# Altium project ControlsBoard.PrjPcb
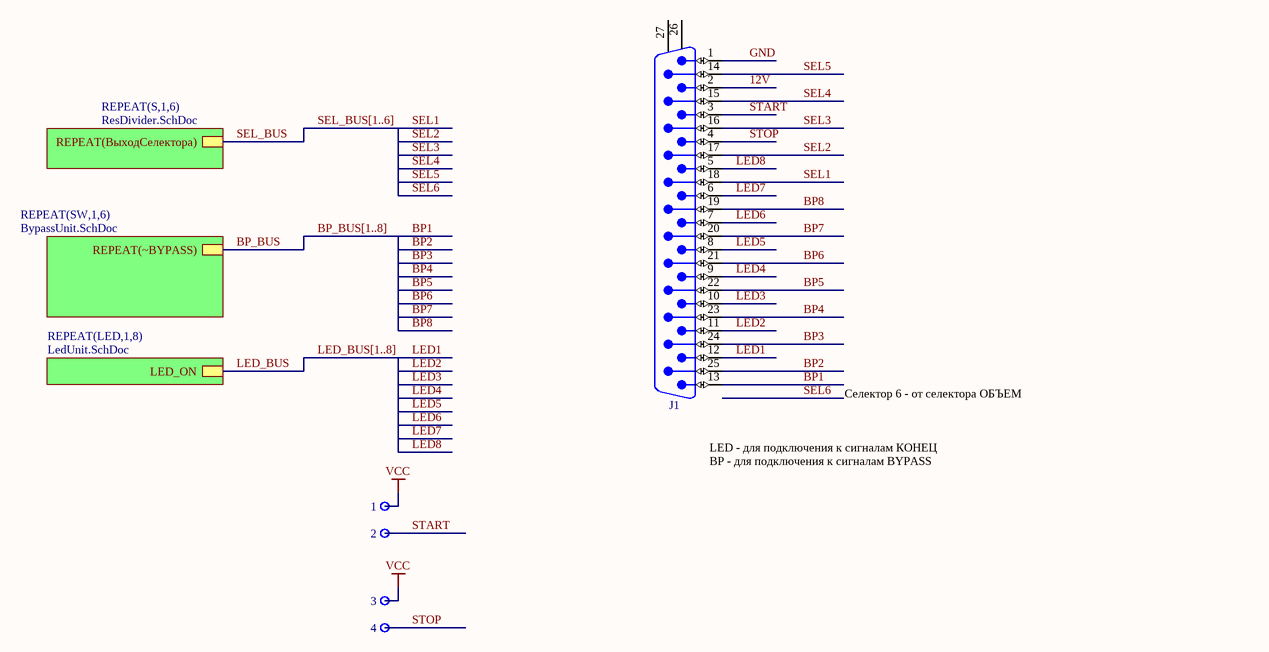
[diagram p0: ControlsBoard.SchDoc]
4 sheets, 173 parts. Net scope: hierarchical (ports join the sheet entries above them; power ports are global).
Board file: ControlsBoard.PcbDoc
Sheets:
  ControlsBoard.SchDoc
    S1 = ResDivider.SchDoc
    S2 = ResDivider.SchDoc
    S3 = ResDivider.SchDoc
    S4 = ResDivider.SchDoc
    S5 = ResDivider.SchDoc
    S6 = ResDivider.SchDoc
    SW1 = BypassUnit.SchDoc
    SW2 = BypassUnit.SchDoc
    SW3 = BypassUnit.SchDoc
    SW4 = BypassUnit.SchDoc
    SW5 = BypassUnit.SchDoc
    SW6 = BypassUnit.SchDoc
    LED1 = LedUnit.SchDoc
    LED2 = LedUnit.SchDoc
    LED3 = LedUnit.SchDoc
    LED4 = LedUnit.SchDoc
    LED5 = LedUnit.SchDoc
    LED6 = LedUnit.SchDoc
    LED7 = LedUnit.SchDoc
    LED8 = LedUnit.SchDoc

## Sheet ControlsBoard.SchDoc
size A1

### Parts
1  Plated Hole  [c180h130]  (value not drawn)
2  Plated Hole  [c180h130]  (value not drawn)
3  Plated Hole  [c180h130]  (value not drawn)
4  Plated Hole  [c180h130]  (value not drawn)
J1  D-Sub  [AMPHENOL_L717DFB25P1ATN]  (value not drawn)

### Sub-sheets
REPEAT(LED,1,8) = LedUnit.SchDoc: LED_ON
REPEAT(S,1,6) = ResDivider.SchDoc: REPEAT(ВыходСелектора)
REPEAT(SW,1,6) = BypassUnit.SchDoc: REPEAT(~BYPASS)

### Nets
VCC: 1.1 3.1
12V: J1.2
BP1: J1.13
BP2: J1.25
BP3: J1.24
BP4: J1.23
BP5: J1.22
BP6: J1.21
BP7: J1.20
BP8: J1.19
BP_BUS: sheet REPEAT(SW,1,6)/REPEAT(~BYPASS)
GND: J1.1
LED1: J1.12
LED2: J1.11
LED3: J1.10
LED4: J1.9
LED5: J1.8
LED6: J1.7
LED7: J1.6
LED8: J1.5
SEL1: J1.18
SEL2: J1.17
SEL3: J1.16
SEL4: J1.15
SEL5: J1.14
SEL_BUS: sheet REPEAT(S,1,6)/REPEAT(ВыходСелектора)
START: 2.1 J1.3
STOP: 4.1 J1.4

Not connected (* = marked no-connect by the designer): J1 26 27

### Buses and harness runs
bus BP_BUS[1..8]
bus LED_BUS[1..8]
bus SEL_BUS[1..6]

### Notes on the sheet
- Селектор 6 - от селектора ОБЪЕМ
- LED - для подключения к сигналам КОНЕЦ
  BP - для подключения к сигналам BYPASS
  SEL

### Library data of the parts
1-4 = PLATED_HOLE1.3_PAD1.8: Single Terminal Socket; Part Description: Plated Through Hole: Hole Dia.=1.3mm Pad Dia.=1.8mm; Mounted: No; Table: Pads; Part Number: PLATED_HOLE1.3_PAD1.8; Component Kind: Standard (No BOM); Component Type: Standard (No BOM); Pin Count: 1; Family: Plated Hole; Socket: No; SMD: No; Status: None; ComponentHeight: 0mm; Author: CERN DEM JLC; CreateDate: 30.10.2008; LatestRevisionDate: 30.10.2008; PackageDescription: Plated Through Hole: Hole Dia.=1.3mm Pad Dia.=1.8mm
J1 = AMPHENOL_L717DFB25P1ATN: Connector D-sub 25 Male; Part Description: Right Angled D-Sub 25 Male Contacts with Metal Bracket and Front Female Screwlock (UNC4-40); Part Number: AMPHENOL_L717DFB25P1ATN; Component Kind: Standard; Component Type: Standard; Pin Count: 27; Family: D-Sub; Mounted: Yes; Socket: No; SMD: No; Status: None; Manufacturer: AMPHENOL; Manufacturer Part Number: L717DFB25P1ATN; ComponentHeight: 13.4mm; HelpURL: \\cern.ch\dfs\Applications\Altium\Datasheets\AMPHENOL_L717DFB25P1ATN.pdf; Author: CERN DEM JLC; CreateDate: 03.06.2009; LatestRevisionDate: 14.07.2011; Table: AMPHENOL

## Sheet ResDivider.SchDoc
size A3
Used 6 times, as channels S1, S2, S3, S4, S5, S6. Parts and nets are listed once, with the designators drawn on the sheet.
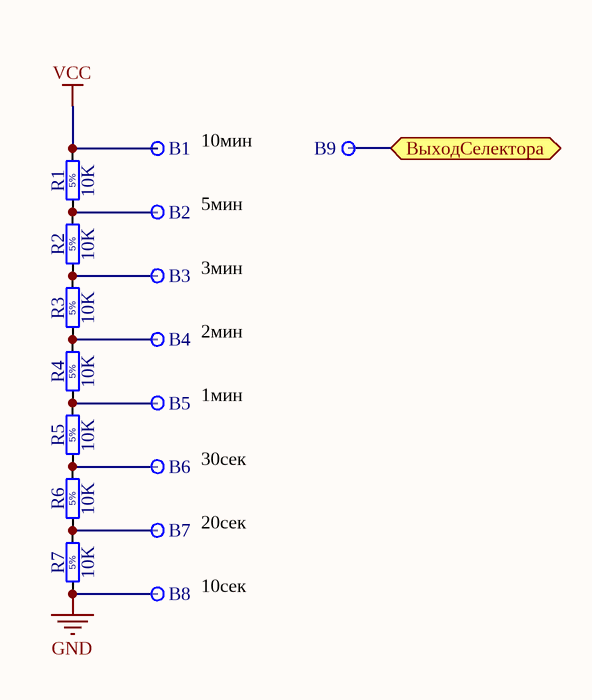
[diagram p1: ResDivider.SchDoc]

### Parts
B1  Plated Hole  [c180h130]  (value not drawn)
B2  Plated Hole  [c180h130]  (value not drawn)
B3  Plated Hole  [c180h130]  (value not drawn)
B4  Plated Hole  [c180h130]  (value not drawn)
B5  Plated Hole  [c180h130]  (value not drawn)
B6  Plated Hole  [c180h130]  (value not drawn)
B7  Plated Hole  [c180h130]  (value not drawn)
B8  Plated Hole  [c180h130]  (value not drawn)
B9  Plated Hole  [c180h130]  (value not drawn)
R1  10K  [RES_ARCOL_RCC025]
R2  10K  [RES_ARCOL_RCC025]
R3  10K  [RES_ARCOL_RCC025]
R4  10K  [RES_ARCOL_RCC025]
R5  10K  [RES_ARCOL_RCC025]
R6  10K  [RES_ARCOL_RCC025]
R7  10K  [RES_ARCOL_RCC025]

### Ports
ВыходСелектора

### Nets
GND: B8.1 R7.1
VCC: B1.1 R1.2
ВыходСелектора: B9.1 ; port ВыходСелектора
NetB2_1: B2.1 R1.1 R2.2
NetB3_1: B3.1 R2.1 R3.2
NetB4_1: B4.1 R3.1 R4.2
NetB5_1: B5.1 R4.1 R5.2
NetB6_1: B6.1 R5.1 R6.2
NetB7_1: B7.1 R6.1 R7.2

### Channels
S1: designators end in _S1; ports ВыходСелектора=SEL_BUS1
S2: designators end in _S2; ports ВыходСелектора=SEL_BUS2
S3: designators end in _S3; ports ВыходСелектора=SEL_BUS3
S4: designators end in _S4; ports ВыходСелектора=SEL_BUS4
S5: designators end in _S5; ports ВыходСелектора=SEL_BUS5
S6: designators end in _S6; ports ВыходСелектора=SEL_BUS6

### Notes on the sheet
- 10мин
- 5мин
- 3мин
- 2мин
- 1мин
- 30сек
- 20сек
- 10сек
- (in symbol RCF_5K1_5%_0.25W_+10-6PPM_ARCOL_RCC025) 5%

### Library data of the parts
B1-B9 = PLATED_HOLE1.3_PAD1.8: as 1 on sheet ControlsBoard; Part Number: PLATED_HOLE1.3_PAD1.8; Component Kind: Standard (No BOM); Component Type: Standard (No BOM); Pin Count: 1; Family: Plated Hole; Socket: No; SMD: No; Status: None; ComponentHeight: 0mm; Author: CERN DEM JLC; CreateDate: 30.10.2008; LatestRevisionDate: 30.10.2008; PackageDescription: Plated Through Hole: Hole Dia.=1.3mm Pad Dia.=1.8mm
R1-R7 = RCF_5K1_5%_0.25W_+10-6PPM_ARCOL_RCC025: Resistor - 5%; Part Description: Solid Carbon Resistor RCC Series; Manufacturer: ARCOL; Manufacturer Part Number: RCC025 5k1 J; Power: 0.25W; TC: +10-6ppm/°C; Table: Resistors THD; Part Number: RCF_5K1_5%_0.25W_+10-6PPM_ARCOL_RCC025; Component Kind: Standard; Component Type: Standard; Pin Count: 2; Value: 10K; Status: None; Tolerance: ±5%; Case: LS10.16 L6.3 x D2.4; Mounted: Yes; Socket: No; SMD: No; ComponentHeight: 2.5mm; HelpURL: \\cern.ch\dfs\Applications\Altium\Datasheets\RCF_ARCOL_RCC025.pdf; Author: CERN DEM JLC; CreateDate: 30.10.2013; LatestRevisionDate: 30.10.2013

## Sheet BypassUnit.SchDoc
size A4
Used 6 times, as channels SW1, SW2, SW3, SW4, SW5, SW6. Parts and nets are listed once, with the designators drawn on the sheet.
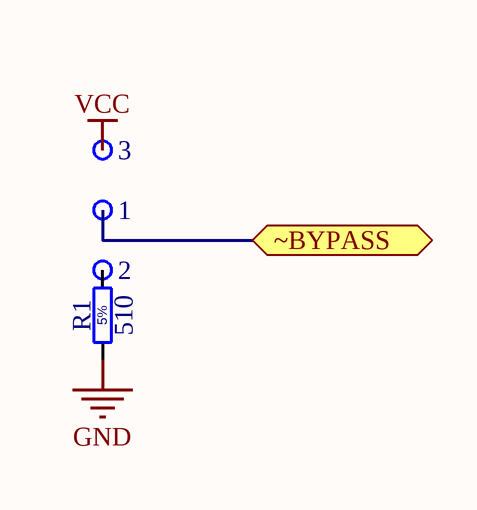
[diagram p2: BypassUnit.SchDoc]

### Parts
1  Plated Hole  [c180h130]  (value not drawn)
2  Plated Hole  [c180h130]  (value not drawn)
3  Plated Hole  [c180h130]  (value not drawn)
R1  510  [RES_ARCOL_RCC025]

### Ports
~BYPASS

### Nets
GND: R1.1
VCC: 3.1
~BYPASS: 1.1 ; port ~BYPASS
Net2_1: 2.1 R1.2

### Channels
SW1: designators end in _SW1; ports ~BYPASS=BP_BUS1
SW2: designators end in _SW2; ports ~BYPASS=BP_BUS2
SW3: designators end in _SW3; ports ~BYPASS=BP_BUS3
SW4: designators end in _SW4; ports ~BYPASS=BP_BUS4
SW5: designators end in _SW5; ports ~BYPASS=BP_BUS5
SW6: designators end in _SW6; ports ~BYPASS=BP_BUS6

### Notes on the sheet
- (in symbol RCF_5K1_5%_0.25W_+10-6PPM_ARCOL_RCC025) 5%

### Library data of the parts
1-3 = PLATED_HOLE1.3_PAD1.8: as 1 on sheet ControlsBoard; Part Number: PLATED_HOLE1.3_PAD1.8; Component Kind: Standard (No BOM); Component Type: Standard (No BOM); Pin Count: 1; Family: Plated Hole; Socket: No; SMD: No; Status: None; ComponentHeight: 0mm; Author: CERN DEM JLC; CreateDate: 30.10.2008; LatestRevisionDate: 30.10.2008; PackageDescription: Plated Through Hole: Hole Dia.=1.3mm Pad Dia.=1.8mm
R1 = RCF_5K1_5%_0.25W_+10-6PPM_ARCOL_RCC025: as R1 on sheet ResDivider; Part Number: RCF_5K1_5%_0.25W_+10-6PPM_ARCOL_RCC025; Component Kind: Standard; Component Type: Standard; Pin Count: 2; Value: 510; Status: None; Tolerance: ±5%; Case: LS10.16 L6.3 x D2.4; Mounted: Yes; Socket: No; SMD: No; ComponentHeight: 2.5mm; HelpURL: \\cern.ch\dfs\Applications\Altium\Datasheets\RCF_ARCOL_RCC025.pdf; Author: CERN DEM JLC; CreateDate: 30.10.2013; LatestRevisionDate: 30.10.2013

## Sheet LedUnit.SchDoc
size A4
Used 8 times, as channels LED1, LED2, LED3, LED4, LED5, LED6, LED7, LED8. Parts and nets are listed once, with the designators drawn on the sheet.
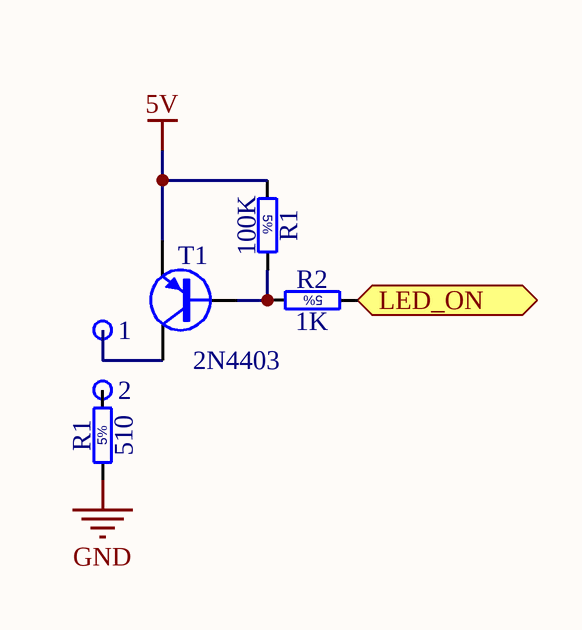
[diagram p3: LedUnit.SchDoc]

### Parts
(Parts that share a designator on the sheet are numbered #1, #2 ... from top to bottom, then left to right.)
1  Plated Hole  [c180h130]  (value not drawn)
2  Plated Hole  [c180h130]  (value not drawn)
R1#1  100K  [RES_ARCOL_RCC025]
R1#2  510  [RES_ARCOL_RCC025]
R2  1K  [RES_ARCOL_RCC025]
T1  2N4403  [TO-92AA-P254]

### Ports
LED_ON

### Nets
5V: R1#1.2 T1.1(E)
GND: R1#2.1
LED_ON: R2.1 ; port LED_ON
Net1_1: 1.1 T1.3(C)
Net2_1: 2.1 R1#2.2
NetR1#1_1: R1#1.1 R2.2 T1.2(B)

### Channels
LED1: designators 1=1_LED1 2=2_LED1 R1=R1_LED1#2 R1=R1_LED1#1 R2=R2_LED1 T1=T1_LED1; ports LED_ON=LED_BUS
LED2: designators 1=1_LED2 2=2_LED2 R1=R1_LED2#2 R1=R1_LED2#1 R2=R2_LED2 T1=T1_LED2; ports LED_ON=LED_BUS
LED3: designators 1=1_LED3 2=2_LED3 R1=R1_LED3#2 R1=R1_LED3#1 R2=R2_LED3 T1=T1_LED3; ports LED_ON=LED_BUS
LED4: designators 1=1_LED4 2=2_LED4 R1=R1_LED4#2 R1=R1_LED4#1 R2=R2_LED4 T1=T1_LED4; ports LED_ON=LED_BUS
LED5: designators 1=1_LED5 2=2_LED5 R1=R1_LED5#2 R1=R1_LED5#1 R2=R2_LED5 T1=T1_LED5; ports LED_ON=LED_BUS
LED6: designators 1=1_LED6 2=2_LED6 R1=R1_LED6#2 R1=R1_LED6#1 R2=R2_LED6 T1=T1_LED6; ports LED_ON=LED_BUS
LED7: designators 1=1_LED7 2=2_LED7 R1=R1_LED7#2 R1=R1_LED7#1 R2=R2_LED7 T1=T1_LED7; ports LED_ON=LED_BUS
LED8: designators 1=1_LED8 2=2_LED8 R1=R1_LED8#2 R1=R1_LED8#1 R2=R2_LED8 T1=T1_LED8; ports LED_ON=LED_BUS

### Notes on the sheet
- (in symbol RCF_5K1_5%_0.25W_+10-6PPM_ARCOL_RCC025) 5%

### Library data of the parts
1 2 = PLATED_HOLE1.3_PAD1.8: as 1 on sheet ControlsBoard; Part Number: PLATED_HOLE1.3_PAD1.8; Component Kind: Standard (No BOM); Component Type: Standard (No BOM); Pin Count: 1; Family: Plated Hole; Socket: No; SMD: No; Status: None; ComponentHeight: 0mm; Author: CERN DEM JLC; CreateDate: 30.10.2008; LatestRevisionDate: 30.10.2008; PackageDescription: Plated Through Hole: Hole Dia.=1.3mm Pad Dia.=1.8mm
R1#1 R1#2 R2 = RCF_5K1_5%_0.25W_+10-6PPM_ARCOL_RCC025: as R1 on sheet ResDivider; Part Number: RCF_5K1_5%_0.25W_+10-6PPM_ARCOL_RCC025; Component Kind: Standard; Component Type: Standard; Pin Count: 2; Status: None; Tolerance: ±5%; Case: LS10.16 L6.3 x D2.4; Mounted: Yes; Socket: No; SMD: No; ComponentHeight: 2.5mm; HelpURL: \\cern.ch\dfs\Applications\Altium\Datasheets\RCF_ARCOL_RCC025.pdf; Author: CERN DEM JLC; CreateDate: 30.10.2013; LatestRevisionDate: 30.10.2013
  R1#1: Value: 100K
  R1#2: Value: 510
  R2: Value: 1K
T1 = 2N3906RL1G: PNP Transistor; Part Description: 40V 200mA PNP General Purpose Amplifier; Manufacturer: ON SEMICONDUCTOR; Table: Transistors; Part Number: 2N3906RL1G; Component Kind: Standard; Component Type: Standard; Device: 2N3906RL1G; PackageDescription: TO-92 (TO226), Pitch 2.54mm, Flat Index, 3 In-Line, Bent Leads, Body Dia. 5.3mm; Manufacturer Part Number: 2N3906RL1G; Pin Count: 3; Case: TO-92; Mounted: Yes; Socket: No; SMD: No; ComponentHeight: 7.7mm; HelpURL: \\cern.ch\dfs\Applications\Altium\Datasheets\2N3906RL1G.pdf; Author: CERN DEM JLC; CreateDate: 23.09.2009; LatestRevisionDate: 23.09.2009

## Nets that join several sheets
5V: LED1 (R1_LED1#1.2 T1_LED1.1), LED2 (R1_LED2#1.2 T1_LED2.1), LED3 (R1_LED3#1.2 T1_LED3.1), LED4 (R1_LED4#1.2 T1_LED4.1), LED5 (R1_LED5#1.2 T1_LED5.1), LED6 (R1_LED6#1.2 T1_LED6.1), LED7 (R1_LED7#1.2 T1_LED7.1), LED8 (R1_LED8#1.2 T1_LED8.1)
GND: S1 (B8_S1.1 R7_S1.1), S2 (B8_S2.1 R7_S2.1), S3 (B8_S3.1 R7_S3.1), S4 (B8_S4.1 R7_S4.1), S5 (B8_S5.1 R7_S5.1), S6 (B8_S6.1 R7_S6.1), SW1 (R1_SW1.1), SW2 (R1_SW2.1), SW3 (R1_SW3.1), SW4 (R1_SW4.1), SW5 (R1_SW5.1), SW6 (R1_SW6.1), LED1 (R1_LED1#2.1), LED2 (R1_LED2#2.1), LED3 (R1_LED3#2.1), LED4 (R1_LED4#2.1), LED5 (R1_LED5#2.1), LED6 (R1_LED6#2.1), LED7 (R1_LED7#2.1), LED8 (R1_LED8#2.1)
VCC: ControlsBoard (1.1 3.1), S1 (B1_S1.1 R1_S1.2), S2 (B1_S2.1 R1_S2.2), S3 (B1_S3.1 R1_S3.2), S4 (B1_S4.1 R1_S4.2), S5 (B1_S5.1 R1_S5.2), S6 (B1_S6.1 R1_S6.2), SW1 (3_SW1.1), SW2 (3_SW2.1), SW3 (3_SW3.1), SW4 (3_SW4.1), SW5 (3_SW5.1), SW6 (3_SW6.1)
LED_BUS: LED1 (R2_LED1.1), LED2 (R2_LED2.1), LED3 (R2_LED3.1), LED4 (R2_LED4.1), LED5 (R2_LED5.1), LED6 (R2_LED6.1), LED7 (R2_LED7.1), LED8 (R2_LED8.1)